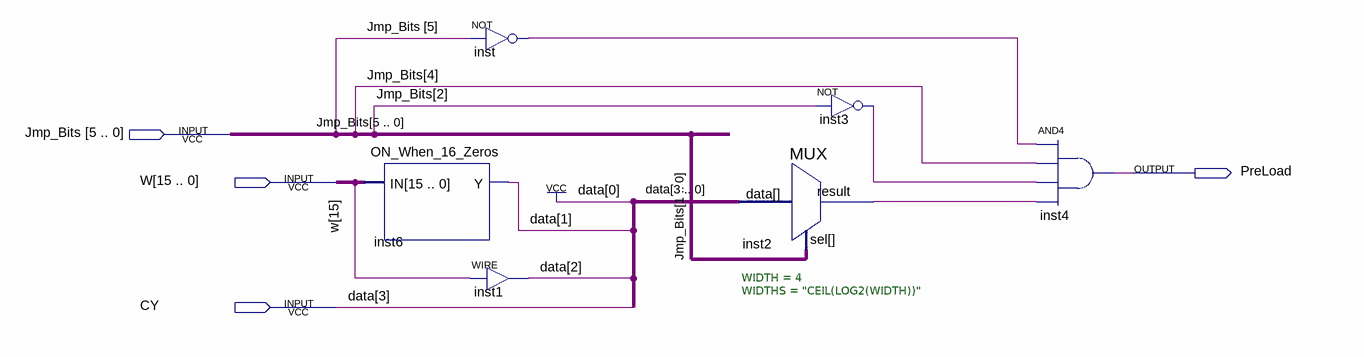
[diagram p0: schematic sheet]
// Quartus schematic Pre_Load_Block.bdf as structural Verilog: 6 symbols, 4 pins
module Pre_Load_Block (
  input  [5:0] Jmp_Bits,
  input  [15:0] W,
  input  CY,
  output PreLoad
);

  wire inst2_result, inst3_out, inst_out;
  wire [2:1] data;

  ON_When_16_Zeros inst6 (.IN(W), .Y(data[1]));
  not inst (inst_out, Jmp_Bits[5]);
  assign data[2] = W[15];  // WIRE inst1
  MUX #(.WIDTH(4), .WIDTHS("CEIL(LOG2(WIDTH))")) inst2 (
    .data({CY, data, 1'b1}), .sel(Jmp_Bits[1:0]), .result(inst2_result));
  not inst3 (inst3_out, Jmp_Bits[2]);
  and inst4 (PreLoad, inst_out, Jmp_Bits[4], inst3_out, inst2_result);

  // Other names for the same wires on the sheet: data[3] = CY
endmodule
